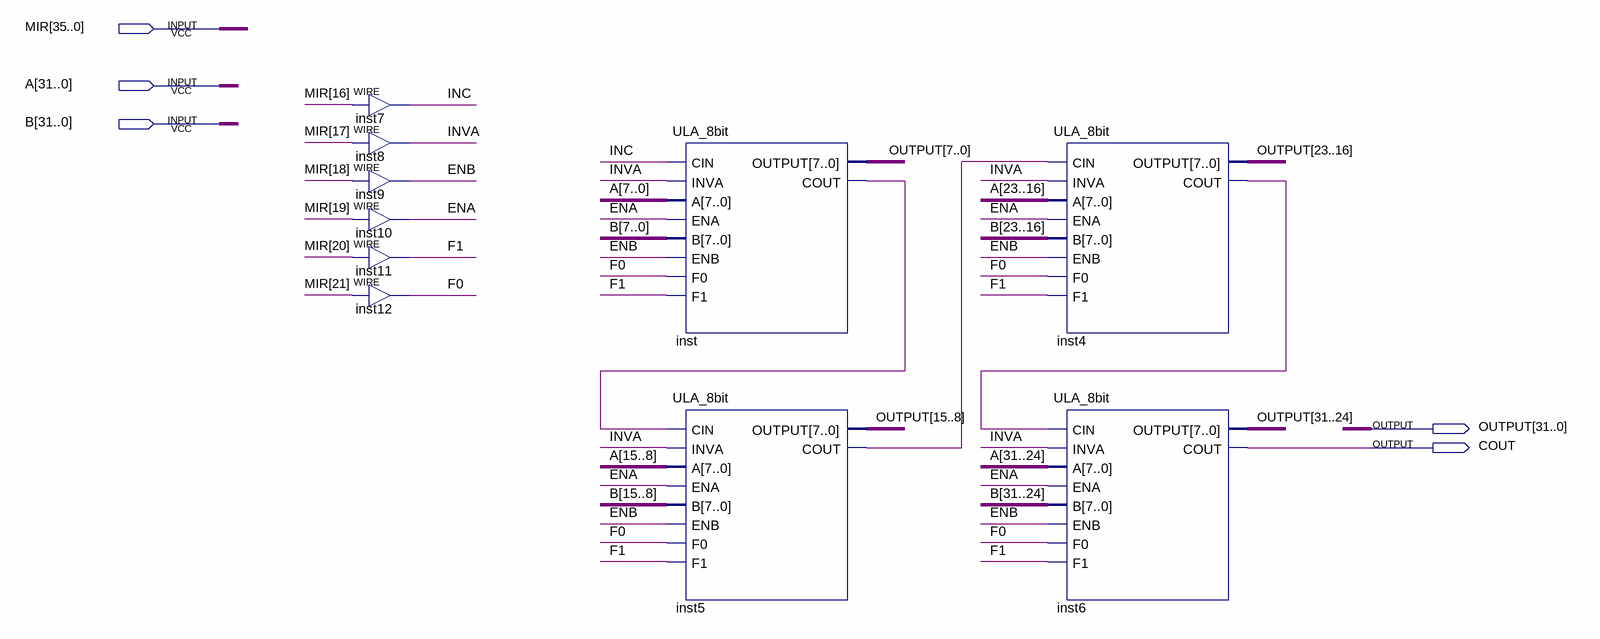
[diagram p0: schematic sheet]
// Quartus schematic ULA_32bit.bdf as structural Verilog: 10 symbols, 5 pins
module ULA_32bit (
  input  [35:0] MIR,
  input  [31:0] A,
  input  [31:0] B,
  output [31:0] OUTPUT,
  output COUT
);

  wire ENA, ENB, F0, F1, INC, inst4_cout, inst5_cout, inst_cout, INVA;

  assign INC = MIR[16];  // WIRE inst7
  assign INVA = MIR[17];  // WIRE inst8
  assign ENB = MIR[18];  // WIRE inst9
  assign ENA = MIR[19];  // WIRE inst10
  assign F1 = MIR[20];  // WIRE inst11
  assign F0 = MIR[21];  // WIRE inst12
  ULA_8bit inst (
    .CIN(INC), .INVA(INVA), .A(A[7:0]), .ENA(ENA), .B(B[7:0]), .ENB(ENB), .F0(F0), .F1(F1),
    .OUTPUT(OUTPUT[7:0]), .COUT(inst_cout));
  ULA_8bit inst5 (
    .CIN(inst_cout), .INVA(INVA), .A(A[15:8]), .ENA(ENA), .B(B[15:8]), .ENB(ENB), .F0(F0), .F1(F1),
    .OUTPUT(OUTPUT[15:8]), .COUT(inst5_cout));
  ULA_8bit inst4 (
    .CIN(inst5_cout), .INVA(INVA), .A(A[23:16]), .ENA(ENA), .B(B[23:16]), .ENB(ENB), .F0(F0), .F1(F1),
    .OUTPUT(OUTPUT[23:16]), .COUT(inst4_cout));
  ULA_8bit inst6 (
    .CIN(inst4_cout), .INVA(INVA), .A(A[31:24]), .ENA(ENA), .B(B[31:24]), .ENB(ENB), .F0(F0), .F1(F1),
    .OUTPUT(OUTPUT[31:24]), .COUT(COUT));
endmodule
